# Altium project PR2387.PrjPcb (part 1 of 2)
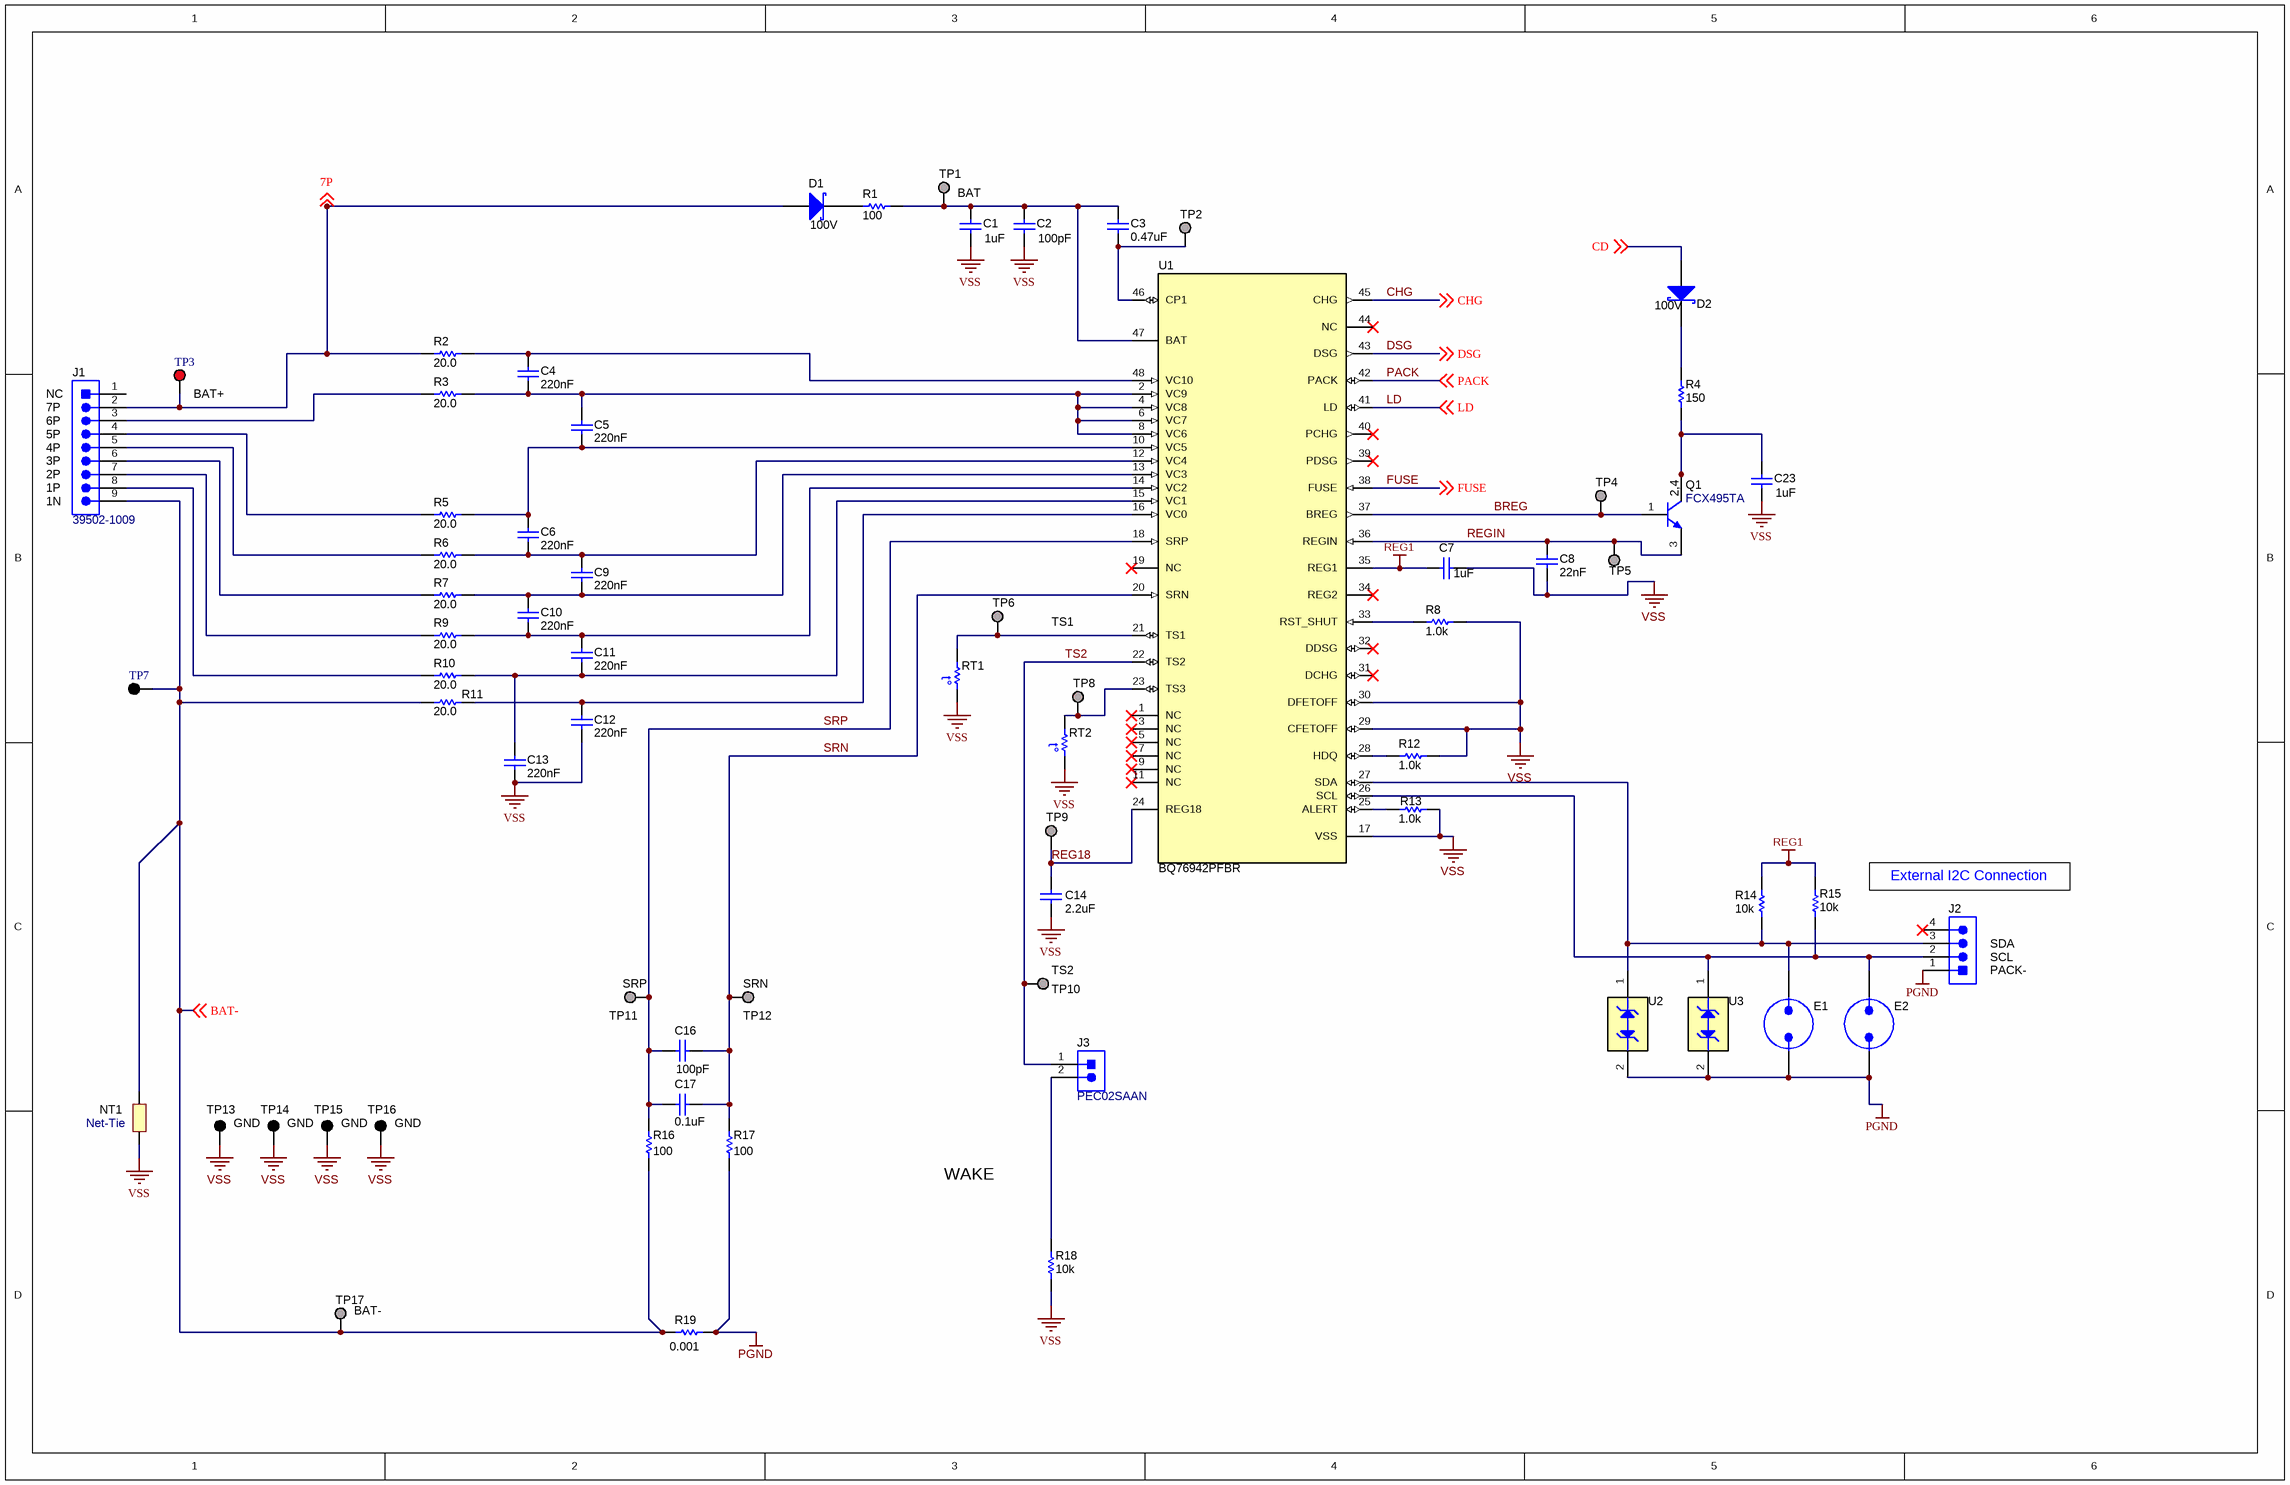
[diagram p0: PR2387_Monitor.SchDoc]
PCB_Rev: A; PRJ_Customer: Test Board; PRJ_Title: BQ76942 7S 2-layer Test Board; SCH_Rev: A; TID: N/A
3 sheets, 131 parts. Net scope: global (net labels, ports and power ports of the same name join across sheets).
Board file: PR2387.PcbDoc
Sheets:
  PR2387_Monitor.SchDoc
  PR2387_FETs.SchDoc
  PR2387_Hardware.SchDoc

## Sheet PR2387_Monitor.SchDoc: Monitor
size 431 x 279 mm; Date: Not shown in title block; ApprovedBy: Not shown in title block; CheckedBy: Not shown in title block; Author: Not shown in title block; CompanyName: Not shown in title block; Engineer: Not shown in title block; Organization: Not shown in title block; Address1: Not shown in title block; Address2: Not shown in title block; Address3: Not shown in title block; Address4: Not shown in title block; DocumentNumber: 1; Revision: Use project parameter SCH_Rev; SheetNumber: 1; SheetTotal: 3; PageSetup: Record=PageOptions|CenterHorizontal=True|CenterVertical=True|PrintScale=1.00|XCorrection=1.00|YCorrection=1.00|PrintKind=0|BorderSize=5000000|LeftOffset=0|BottomOffset=0|Orientation=2|PaperLength=1000|PaperWidth=1000|Scale=100|PaperSource=15|PrintQuality=600|MediaType=1|DitherType=10|PaperKind=Letter|PrintScaleMode=1; CurrentTime: Not shown in title block; CurrentDate: Not shown in title block; Time: Not shown in title block; DocumentFullPathAndName: Not shown in title block; DocumentName: Not shown in title block; ModifiedDate: Not shown in title block; ImagePath: Not shown in title block

### Parts
C1  ValueDisplayed: 1uF  [1206_180]  (hidden comment: C3216X7R2A105K160AA)
C2  ValueDisplayed: 100pF  [0603]  (hidden comment: GCM1885C2A101JA16D)
C3  ValueDisplayed: 0.47uF  [0805_HV]  (hidden comment: GCM219R71E474KA55D)
C4  Cap_F: 220nF  [0603]  (hidden comment: C1608X7R1H224K080AB)
C5  Cap_F: 220nF  [0603]  (hidden comment: C1608X7R1H224K080AB)
C6  Cap_F: 220nF  [0603]  (hidden comment: C1608X7R1H224K080AB)
C7  ValueDisplayed: 1uF  [0805_HV]  (hidden comment: EMK212B7105KG-T)
C8  Cap_F: 22nF  [0603]  (hidden comment: C0603C223K4RACTU)
C9  Cap_F: 220nF  [0603]  (hidden comment: C1608X7R1H224K080AB)
C10  Cap_F: 220nF  [0603]  (hidden comment: C1608X7R1H224K080AB)
C11  Cap_F: 220nF  [0603]  (hidden comment: C1608X7R1H224K080AB)
C12  Cap_F: 220nF  [0603]  (hidden comment: C1608X7R1H224K080AB)
C13  Cap_F: 220nF  [0603]  (hidden comment: C1608X7R1H224K080AB)
C14  ValueDisplayed: 2.2uF  [0805_HV]  (hidden comment: EMK212B7225KG-T)
C16  ValueDisplayed: 100pF  [0603]  (hidden comment: C0603C101J5GACTU)
C17  ValueDisplayed: 0.1uF  [0603]  (hidden comment: 885012206095)
C23  ValueDisplayed: 1uF  [1206_180]  (hidden comment: C3216X7R2A105K160AA)
D1  value 100V  [SOD-123]  (hidden comment: BAT46W-7-F)
D2  value 100V  [SOD-123]  (hidden comment: BAT46W-7-F)
E1  Spark Gap  [SPARK_GAP2]  (value not drawn)  (no BOM)
E2  Spark Gap  [SPARK_GAP2]  (value not drawn)  (no BOM)
J1  39502-1009  [Molex_39502-1009]
J2  22/05/3041  [CONN_22-05-3041]  (value not drawn)
J3  PEC02SAAN  [CONN_PEC02SAAN]
NT1  Net-Tie  [Net-Tie_10milWide_30milLong]  (net tie, no BOM)
Q1  FCX495TA  [SOT-89-3]
R1  ValueDisplayed: 100  [0603]  (hidden comment: Resistor)
R2  ValueDisplayed: 20.0  [1206]  (hidden comment: CRCW120620R0FKEA)
R3  ValueDisplayed: 20.0  [1206]  (hidden comment: CRCW120620R0FKEA)
R4  ValueDisplayed: 150  [2512]  (hidden comment: CRCW2512150RJNEG)
R5  ValueDisplayed: 20.0  [1206]  (hidden comment: CRCW120620R0FKEA)
R6  ValueDisplayed: 20.0  [1206]  (hidden comment: CRCW120620R0FKEA)
R7  ValueDisplayed: 20.0  [1206]  (hidden comment: CRCW120620R0FKEA)
R8  ValueDisplayed: 1.0k  [0603]  (hidden comment: CRCW06031K00JNEA)
R9  ValueDisplayed: 20.0  [1206]  (hidden comment: CRCW120620R0FKEA)
R10  ValueDisplayed: 20.0  [1206]  (hidden comment: CRCW120620R0FKEA)
R11  ValueDisplayed: 20.0  [1206]  (hidden comment: CRCW120620R0FKEA)
R12  ValueDisplayed: 1.0k  [0603]  (hidden comment: CRCW06031K00JNEA)
R13  ValueDisplayed: 1.0k  [0603]  (hidden comment: CRCW06031K00JNEA)
R14  ValueDisplayed: 10k  [0603]  (hidden comment: CRCW060310K0JNEA)
R15  ValueDisplayed: 10k  [0603]  (hidden comment: CRCW060310K0JNEA)
R16  ValueDisplayed: 100  [0603]  (hidden comment: Resistor)
R17  ValueDisplayed: 100  [0603]  (hidden comment: Resistor)
R18  ValueDisplayed: 10k  [0603]  (hidden comment: CRCW060310K0JNEA)
R19  ValueDisplayed: 0.001  [1210M]  (hidden comment: Resistor)
RT1  Thermistor  [THERMISTOR_103AT-2]  (value not drawn)
RT2  Thermistor  [THERMISTOR_103AT-2]  (value not drawn)
TP1  TESTPOINT  [TP_VIA_060RND040]  (value not drawn)  (no BOM)
TP2  TESTPOINT  [TP_VIA_060RND040]  (value not drawn)  (no BOM)
TP3  TESTPOINT  [Keystone5010]  (value not drawn)
TP4  TESTPOINT  [TP_VIA_060RND040]  (value not drawn)  (no BOM)
TP5  TESTPOINT  [TP_VIA_060RND040]  (value not drawn)  (no BOM)
TP6  TESTPOINT  [TP_VIA_060RND040]  (value not drawn)  (no BOM)
TP7  TESTPOINT  [Keystone5011]  (value not drawn)
TP8  TESTPOINT  [TP_VIA_060RND040]  (value not drawn)  (no BOM)
TP9  TESTPOINT  [TP_VIA_060RND040]  (value not drawn)  (no BOM)
TP10  TESTPOINT  [TP_VIA_060RND040]  (value not drawn)  (no BOM)
TP11  TESTPOINT  [TP_VIA_060RND040]  (value not drawn)  (no BOM)
TP12  TESTPOINT  [TP_VIA_060RND040]  (value not drawn)  (no BOM)
TP13  5006  [Keystone5006]  (value not drawn)
TP14  5006  [Keystone5006]  (value not drawn)
TP15  5006  [Keystone5006]  (value not drawn)
TP16  5006  [Keystone5006]  (value not drawn)
TP17  TESTPOINT  [TP_VIA_060RND040]  (value not drawn)  (no BOM)
U1  BQ76942PFBR  [PFB0048A_N]
U2  TPD1E10B06DPYR  [DPY0002A]  (value not drawn)
U3  TPD1E10B06DPYR  [DPY0002A]  (value not drawn)

### Nets
PGND: E1.2 E2.2 J2.1 R17.1 R19.1 U2.2(A) U3.2(A)
REG1: C7.2 R14.1 R15.1 U1.35(REG1)
VSS: C1.2 C2.2 C7.1 C8.1 C12.2 C13.2 C14.1 C23.2 NT1.1 R8.1 R12.1 R13.1 R18.1 RT1.2 RT2.2 TP13.1 TP14.1 TP15.1 TP16.1 U1.17(VSS) U1.29(CFETOFF) U1.30(DFETOFF)
7P: D1.2(A) J1.2 R2.1 TP3.1 ; off-sheet 7P
BAT-: J1.9 NT1.2 R11.1 R16.1 R19.2 TP7.1 TP17.1 ; off-sheet BAT-
BREG: Q1.1(B) TP4.1 U1.37(BREG)
CD: D2.2(A) ; off-sheet CD
CHG: U1.45(CHG) ; off-sheet CHG
DSG: U1.43(DSG) ; off-sheet DSG
FUSE: U1.38(FUSE) ; off-sheet FUSE
LD: U1.41(LD) ; off-sheet LD
PACK: U1.42(PACK) ; off-sheet PACK
REG18: C14.2 TP9.1 U1.24(REG18)
REGIN: C8.2 Q1.3(E) TP5.1 U1.36(REGIN)
SRN: C16.1 C17.2 R17.2 TP12.1 U1.20(SRN)
SRP: C16.2 C17.1 R16.2 TP11.1 U1.18(SRP)
TS2: J3.1 TP10.1 U1.22(TS2)
NetC1_1: C1.1 C2.1 C3.1 R1.1 TP1.1 U1.47(BAT)
NetC3_2: C3.2 TP2.1 U1.46(CP1)
NetC4_1: C4.1 R2.2 U1.48(VC10)
NetC4_2: C4.2 C5.1 R3.2 U1.2(VC9) U1.4(VC8) U1.6(VC7) U1.8(VC6)
NetC5_2: C5.2 C6.1 R5.2 U1.10(VC5)
NetC6_2: C6.2 C9.1 R6.2 U1.12(VC4)
NetC9_2: C9.2 C10.1 R7.2 U1.13(VC3)
NetC10_2: C10.2 C11.1 R9.2 U1.14(VC2)
NetC11_2: C11.2 C13.1 R10.2 U1.15(VC1)
NetC12_1: C12.1 R11.2 U1.16(VC0)
NetC23_1: C23.1 Q1.2(C) Q1.4(C) R4.1
NetD1_1: D1.1(K) R1.2
NetD2_1: D2.1(K) R4.2
NetE1_1: E1.1 J2.3 R14.2 U1.27(SDA) U2.1(K)
NetE2_1: E2.1 J2.2 R15.2 U1.26(SCL) U3.1(K)
NetJ1_3: J1.3 R3.1
NetJ1_4: J1.4 R5.1
NetJ1_5: J1.5 R6.1
NetJ1_6: J1.6 R7.1
NetJ1_7: J1.7 R9.1
NetJ1_8: J1.8 R10.1
NetJ3_2: J3.2 R18.2
NetR8_2: R8.2 U1.33(RST_SHUT)
NetR12_2: R12.2 U1.28(HDQ)
NetR13_2: R13.2 U1.25(ALERT)
NetRT1_1: RT1.1 TP6.1 U1.21(TS1)
NetRT2_1: RT2.1 TP8.1 U1.23(TS3)

Not connected (* = marked no-connect by the designer): J1 1; J2 4*; U1 1(NC)* 3(NC)* 5(NC)* 7(NC)* 9(NC)* 11(NC)* 19(NC)* 31(DCHG)* 32(DDSG)* 34(REG2)* 39(PDSG)* 40(PCHG)* 44(NC)*

### Notes on the sheet
- BAT
- (near J1) 6P
- (near J1) 5P
- (near J1) 7P
- (near J1) NC
- (near TP3) BAT+
- (near J1) 2P
- (near J1) 1P
- (near J1) 1N
- (near J1) 4P
- (near J1) 3P
- TS1
- External I2C Connection
- (near TP10) TS2
- (near J2) PACK-
- (near J2) SDA
- (near J2) SCL
- (near TP11) SRP
- (near TP12) SRN
- GND
- (near TP16) GND
- WAKE
- (near TP17) BAT-
- (in symbol CMP-0000510-2) 2,4
- (in symbol CMP-0002341-2) t°

### Library data of the parts
C1 C23 = CMP-0008710-2: CAP, CERM, 1 uF, 100 V, +/- 10%, X7R, 1206; Manufacturer: TDK; TaMin_C: -55°C; ESR_ohm: 4.575m; Polarized: N; SizeAreaWB_mm2: 10.92; Value1: 0.004575 ohm; U/M: EA; Value: 1uF; TaMax_C: 125°C; SizeZ_mm: 1.8; SizeX_mm: 3.2; SizeY_mm: 1.6; Value2: 100V; SizeArea_mm2: 5.12; Cap_F: 1µF; IRMS_A: 3.39639A; AEC Category: Q200; Supplier Part Number 2: 810-C3216X7R2A105K160AA; Publisher: Texas Instruments; Supplier 2: Mouser; TempCo: X7R; Published: 2008-06-19; RoHS: Y; MountType: SMT; Supplier 1: Digi-Key; PackageReference: 1206; Tolerance_%: 10%; Cap_Case: 1206_180; CompType: Capacitor; LatestRevisionDate: 2017-03-09; PartNumber: C3216X7R2A105K160AA; AEC Qualified: N; VDC_V: 100V; ComponentLink1Description: Datasheet link; AEC Grade: N/A; Supplier Part Number 1: 445-4467-1-ND; Technology: Ceramic; ComponentLink1URL: https://product.tdk.com/en/search/capacitor/ceramic/mlcc/info?part_no=C3216X7R2A105K160AA
C2 = CMP-0007130-4: CAP, CERM, 100 pF, 100 V, +/- 5%, C0G/NP0, AEC-Q200 Grade 1, 0603; Manufacturer: MuRata; TaMin_C: -55°C; Polarized: N; SizeAreaWB_mm2: 4.68; Value1: Unknown; U/M: EA; TaMax_C: 125°C; SizeZ_mm: 1; SizeX_mm: 1.6; SizeY_mm: 0.8; Value2: 100V; SizeArea_mm2: 1.28; AEC Qualified: Y; AEC Category: Q200; Value: 100pF; Supplier Part Number 2: 81-GCM1885C2A101JA6D; Publisher: Texas Instruments; Supplier 2: Mouser; TempCo: C0G/NP0; Published: 2008-06-19; RoHS: Y; MountType: SMT; Supplier 1: Digi-Key; PackageReference: 0603; Tolerance_%: 5%; Cap_Case: 0603; CompType: Capacitor; LatestRevisionDate: 2017-03-09; PartNumber: GCM1885C2A101JA16D; Cap_F: 100pF; VDC_V: 100V; ComponentLink1Description: Datasheet link; AEC Grade: 1; Supplier Part Number 1: 490-4771-1-ND; Technology: Ceramic; ComponentLink1URL: http://psearch.murata.com/capacitor/product/GCM1885C2A101JA16%23.pdf
C3 = CMP-0008010-2: CAP, CERM, 0.47 uF, 25 V, +/- 10%, X7R, AEC-Q200 Grade 1, 0805; Manufacturer: MuRata; TaMin_C: -55°C; Polarized: N; SizeAreaWB_mm2: 6.75; Value1: Unknown; U/M: EA; Value: 0.47uF; TaMax_C: 125°C; SizeZ_mm: 1.45; SizeX_mm: 2; SizeY_mm: 1.25; Cap_Case: 0805; Value2: 25V; SizeArea_mm2: 2.5; AEC Qualified: Y; Cap_F: 470nF; AEC Grade: 1; AEC Category: Q200; Supplier Part Number 2: 81-GCM219R71E474KA5D; Publisher: Texas Instruments; Supplier 2: Mouser; TempCo: X7R; Published: 2008-06-19; RoHS: Y; MountType: SMT; Supplier 1: Digi-Key; PackageReference: 0805; Tolerance_%: 10%; CompType: Capacitor; LatestRevisionDate: 2017-03-09; PartNumber: GCM219R71E474KA55D; VDC_V: 25V; ComponentLink1Description: Datasheet link; Supplier Part Number 1: 490-8044-1-ND; Technology: Ceramic; ComponentLink1URL: http://psearch.murata.com/capacitor/product/GCM219R71E474KA55%23.pdf
C4-C6 C9-C13 = CMP-0007047-4: CAP, CERM, 0.22 uF, 50 V, +/- 10%, X7R, 0603; Manufacturer: TDK; TaMin_C: -55°C; Polarized: N; SizeAreaWB_mm2: 4.68; Value1: 0.021699 ohm; U/M: EA; Value: 0.22uF; TaMax_C: 125°C; SizeZ_mm: 1; SizeX_mm: 1.6; SizeY_mm: 0.8; Value2: 50V; SizeArea_mm2: 1.28; AEC Category: Q200; ESR_ohm: 0.021699; IRMS_A: 1.12496A; Publisher: Texas Instruments; TempCo: X7R; Published: 2008-06-19; RoHS: Y; MountType: SMT; PackageReference: 0603; Tolerance_%: 10%; Cap_Case: 0603; CompType: Capacitor; LatestRevisionDate: 2017-03-09; PartNumber: C1608X7R1H224K080AB; AEC Qualified: N; ComponentLink1Description: Datasheet link; AEC Grade: N/A; Technology: Ceramic; ValueDisplayed: 0.22uF; ComponentLink1URL: https://product.tdk.com/en/search/capacitor/ceramic/mlcc/info?part_no=C1608X7R1H224K080AB; Supplier 1: Digi-Key; Supplier 2: Newark; Supplier 3: Mouser; Supplier Part Number 1: 445-7408-1-ND; Supplier Part Number 2: 04X3259; Supplier Part Number 3: 810-C1608X7R1H224K; VDC_V: 50V
C7 = CMP-0008000-2: CAP, CERM, 1 uF, 16 V, +/- 10%, X7R, 0805; Manufacturer: Taiyo Yuden; TaMin_C: -55°C; Polarized: N; SizeAreaWB_mm2: 6.75; Value1: Unknown; U/M: EA; Value: 1uF; TaMax_C: 125°C; SizeZ_mm: 1.45; SizeX_mm: 2; SizeY_mm: 1.25; Cap_Case: 0805; Value2: 16V; SizeArea_mm2: 2.5; Cap_F: 1µF; AEC Category: Q200; Supplier Part Number 2: 1683653; Publisher: Texas Instruments; Supplier 2: Farnell; TempCo: X7R; Published: 2008-06-19; RoHS: Y; MountType: SMT; Supplier 1: Digi-Key; PackageReference: 0805; Tolerance_%: 10%; CompType: Capacitor; LatestRevisionDate: 2017-03-09; PartNumber: EMK212B7105KG-T; AEC Qualified: ?; VDC_V: 16V; ComponentLink1Description: Datasheet link; Supplier Part Number 1: 587-1283-1-ND; Technology: Ceramic; ComponentLink1URL: http://www.yuden.co.jp/ut/product/pdf/djmk_e.pdf
C8 = CMP-0006900-4: CAP, CERM, 0.022 uF, 16 V, +/- 10%, X7R, 0603; Manufacturer: Kemet; TaMin_C: -55°C; Polarized: N; SizeAreaWB_mm2: 4.68; Value1: Unknown; U/M: EA; TaMax_C: 125°C; SizeZ_mm: 1; SizeX_mm: 1.6; SizeY_mm: 0.8; Value2: 16V; SizeArea_mm2: 1.28; AEC Category: Q200; Supplier Part Number 2: 80-C0603C223K4R; Publisher: Texas Instruments; Supplier 2: Mouser; TempCo: X7R; Published: 2008-06-19; RoHS: Y; MountType: SMT; Value: 0.022uF; Supplier 1: Digi-Key; PackageReference: 0603; Tolerance_%: 10%; Cap_Case: 0603; CompType: Capacitor; LatestRevisionDate: 2017-03-09; PartNumber: C0603C223K4RACTU; AEC Qualified: ?; VDC_V: 16V; ComponentLink1Description: Datasheet link; Supplier Part Number 1: 399-1093-1-ND; Technology: Ceramic; ValueDisplayed: 0.022uF; ComponentLink1URL: http://www.kemet.com/kemet/web/homepage/kechome.nsf/vapubfiles/F3102_Y5V.pdf/$file/F3102_Y5V.pdf; Supplier 3: Farnell; Supplier Part Number 3: 1204523
C14 = CMP-0008001-2: CAP, CERM, 2.2 uF, 16 V, +/- 10%, X7R, 0805; Manufacturer: Taiyo Yuden; TaMin_C: -55°C; Polarized: N; SizeAreaWB_mm2: 6.75; Value1: Unknown; U/M: EA; Value: 2.2uF; TaMax_C: 125°C; SizeZ_mm: 1.45; SizeX_mm: 2; SizeY_mm: 1.25; Cap_Case: 0805; Value2: 16V; SizeArea_mm2: 2.5; Cap_F: 2.2µF; AEC Category: Q200; Supplier Part Number 2: 1683654; Publisher: Texas Instruments; Supplier 2: Farnell; TempCo: X7R; Published: 2008-06-19; RoHS: Y; MountType: SMT; Supplier 1: Digi-Key; PackageReference: 0805; Tolerance_%: 10%; CompType: Capacitor; LatestRevisionDate: 2017-03-09; PartNumber: EMK212B7225KG-T; AEC Qualified: ?; VDC_V: 16V; ComponentLink1Description: Datasheet link; Supplier Part Number 1: 587-1431-1-ND; Technology: Ceramic; ComponentLink1URL: http://www.yuden.co.jp/ut/product/pdf/djmk_e.pdf
C16 = CMP-0006841-4: CAP, CERM, 100 pF, 50 V, +/- 5%, C0G/NP0, 0603; Manufacturer: Kemet; TaMin_C: -55°C; Polarized: N; SizeAreaWB_mm2: 4.68; Value1: Unknown; U/M: EA; Value: 100pF; TaMax_C: 125°C; SizeZ_mm: 1; SizeX_mm: 1.6; SizeY_mm: 0.8; Value2: 50V; SizeArea_mm2: 1.28; AEC Category: Q200; Supplier Part Number 2: 80-C0603C101J5G; Publisher: Texas Instruments; Supplier 2: Mouser; Supplier Part Number 3: 1414603; TempCo: C0G/NP0; Supplier 3: Farnell; Published: 2008-06-19; RoHS: Y; MountType: SMT; Supplier 1: Digi-Key; PackageReference: 0603; Tolerance_%: 5%; Cap_Case: 0603; CompType: Capacitor; LatestRevisionDate: 2017-03-09; PartNumber: C0603C101J5GACTU; AEC Qualified: ?; Cap_F: 100pF; VDC_V: 50V; ComponentLink1Description: Datasheet link; Supplier Part Number 1: 399-1061-1-ND; Technology: Ceramic; ComponentLink1URL: http://www.kemet.com/kemet/web/homepage/kechome.nsf/vapubfiles/F3102_Y5V.pdf/$file/F3102_Y5V.pdf
C17 = CMP-0006837-4: CAP, CERM, 0.1 uF, 50 V, +/- 10%, X7R, 0603; Manufacturer: Wurth Elektronik; TaMin_C: -55°C; Polarized: N; SizeAreaWB_mm2: 4.68; Value1: Unknown; U/M: EA; Value: 0.1uF; TaMax_C: 125°C; SizeZ_mm: 1; SizeX_mm: 1.6; SizeY_mm: 0.8; Value2: 50V; SizeArea_mm2: 1.28; Cap_F: 100nF; AEC Category: Q200; Publisher: Texas Instruments; TempCo: X7R; Published: 2008-06-19; RoHS: Y; MountType: SMT; PackageReference: 0603; Tolerance_%: 10%; Cap_Case: 0603; CompType: Capacitor; LatestRevisionDate: 2017-03-09; PartNumber: 885012206095; AEC Qualified: N; ComponentLink1Description: Datasheet link; AEC Grade: N/A; Technology: Ceramic; ComponentLink1URL: http://katalog.we-online.de/pbs/datasheet/885012206095.pdf
D1 D2 = CMP-0028450-2: Diode, Schottky, 100 V, 0.15 A, SOD-123; Manufacturer: Diodes Inc.; Io_A: 150mA; SizeArea_mm2: 6.545; SizeX_mm: 3.85; Value2: 0.6V; Value1: 0.15A; AEC Category: Q101; SizeZ_mm: 1.35; SizeY_mm: 1.7; Green_Lifecycle: Active; Green_REACh: Passed; SizeAreaWB_mm2: 13.095; Vf_V: 600mV; ComponentLink1Description: Datasheet link; MountType: SMT; ComponentLink1URL: http://www.diodes.com/datasheets/ds30044.pdf; Vr_V: 100V; PartNumber: BAT46W-7-F; Type: Schottky; AEC Qualified: ?; Green_EU RoHS-2: Passed; Green_EU RoHS: Passed; CompType: Diode; RoHS: Y; PackageReference: SOD-123
E1 E2 = CMP-0079939-1: CompType: Spark Gap
J1 = CMP-0055280-1: Header(Shrouded), 3.5mm, 9x1, R/A, TH; Manufacturer: Molex; CNHeader: FALSE; Current_A: 8A; Shrouded: Y; Gender: Male; Voltage_V: 300V; Row_Count: 1; Pitch_mm: 3.5; ContactFinish: Tin; ComponentLink1URL: http://www.molex.com/pdm_docs/sd/395021002_sd.pdf; Supplier Part Number 2: 03N5777; Publisher: Texas Instruments; Supplier 2: Newark; Supplier Part Number 3: 538-39502-1009; Color: Black; Supplier 3: Mouser; RoHS: Y; MountType: TH; Supplier 1: Digi-Key; PackageReference: Header(Shrouded), 3.5mm, 9x1, R/A, TH; PinCount: 9; CompType: Header; LatestRevisionDate: 26/05/2017; PartNumber: 39502-1009; Orientation: R/A; ComponentLink1Description: Datasheet URL; Supplier Part Number 1: WM7777-ND; CT: FALSE; Cert_UL: Y
J2 = CMP-0055187-1: Header (friction lock), 100mil, 4x1, R/A, TH; Manufacturer: Molex; Green_Lifecycle: Active; Green_REACh: Passed; CNHeader: FALSE; ComponentLink1URL: http://www.molex.com/pdm_docs/sd/022053041_sd.pdf; PackageReference: 4x1 R/A Header; PartNumber: 22/05/3041; ComponentLink1Description: Datasheet URL; CompType: Header; RoHS: Y; MountType: TH; Publisher: Texas Instruments; LatestRevisionDate: 26/05/2017; Supplier 1: Digi-Key; Supplier Part Number 1: WM4302-ND; Supplier 2: Newark; Supplier Part Number 2: 27C1932; Supplier 3: Mouser; Supplier Part Number 3: 538-22-05-3041; Green_EU RoHS: Passed; Green_EU RoHS-2: Passed; CT: FALSE
J3 = CMP-0002337-1: Header, 100mil, 2x1, Tin, TH; Manufacturer: Sullins Connector Solutions; CNHeader: TRUE; Current_A: 3A; Green_Lifecycle: Not Set; Shrouded: N; Gender: Male; Green_REACh: Incomplete; Voltage_V: 1.8kV; Row_Count: 1; Pitch_mm: 2.54; CT: FALSE; Cert_UL: Y; ComponentLink1URL: http://www.sullinscorp.com/catalogs/77_PAGE108-109_.100_MALE_HDR.pdf; ClassName: Header; Publisher: Texas Instruments; Color: Black; RoHS: Y; MountType: TH; Green_EU RoHS-2: Incomplete; Supplier 1: Digi-Key; Green_EU RoHS: Incomplete; PackageReference: Header, 2 PIN, 100mil, Tin; PinCount: 2; CompType: Header; LatestRevisionDate: 26/05/2017; PartNumber: PEC02SAAN; Orientation: Vertical; ComponentLink1Description: Datasheet URL; Supplier Part Number 1: S1012E-02-ND; ContactFinish: Tin
NT1 = CMP-0078142-3: Single point connection between nets.; MountType: SMT; PackageReference: N/A; CompType: Net-Tie; Library Reference: Net-Tie; Manufacturer: N/A; PartNumber: N/A
Q1 = CMP-0000510-2: Transistor, NPN, 150 V, 1 A, AEC-Q101, SOT-89; Manufacturer: Diodes Inc.; TaMax_C: 150°C; Value2: 300; Value1: 1 A; Vcesat1_V: 200mV; SizeX_mm: 4.1; SizeY_mm: 4.5; TaMin_C: -65°C; IcRated_A: 1A; CompType: BJT; SizeZ_mm: 1.5; AEC Qualified: Y; Value: 150 V; SizeArea_mm2: 18.45; NPN: 1; Vceo_V: 150V; PNP: 0; AEC Category: Q101; SizeAreaWB_mm2: 28.05; U/M: EA; Supplier 2: Newark; Supplier 3: Mouser; Supplier 1: Digi-Key; Supplier Part Number 1: FCX495CT-ND; Supplier Part Number 2: 65T9121; Supplier Part Number 3: 522-FCX495TA; PartNumber: FCX495TA; LatestRevisionDate: 2017-03-09; Publisher: Texas Instruments; ComponentLink1Description: Datasheet link; HfeMax: 300; Published: 2008-07-31; RoHS: Y; PackageReference: SOT-89; MountType: SMT; ComponentLink1URL: https://www.diodes.com/assets/Datasheets/FCX495.pdf
R1 R16 R17 = CMP-0025700-4: RES, 100, 5%, 0.1 W, AEC-Q200 Grade 0, 0603; PartNumber: CRCW0603100RJNEA; Manufacturer: Vishay-Dale; Value: 100; Value_Code: 100R; Power_W: 100mW; Value2: 0.1W; VDC_V: 75V; TempCo: 200 ppm/C; EIA_Code: E24; U/M: EA; SizeArea_mm2: 1.28; SizeX_mm: 1.6; SizeY_mm: 0.8; SizeZ_mm: 1; AEC Category: Q200; AEC Qualified: Y; AEC Grade: 0; CompType: Resistor; SymbolVersion: 2009-05-29; PackageReference: 0603; RoHS: E; Res_ohm: 100; Tolerance_%: 5%; Value1: 5%; MountType: SMT; Technology: Thick Film; Published: 2008-06-26; Publisher: Texas Instruments; LatestRevisionDate: 2017-06-13; ComponentLink1Description: Datasheet link; ComponentLink1URL: http://www.vishay.com/docs/20035/dcrcwe3.pdf; Supplier 1: Digi-Key; Supplier Part Number 1: 541-100GCT-ND; Supplier 2: Newark; Supplier Part Number 2: 59M6764; Supplier 3: Mouser; Supplier Part Number 3: 71-CRCW0603J-100-E3
R2 R3 R5-R7 R9-R11 = CMP-0016781-3: RES, 20.0, 1%, 0.25 W, AEC-Q200 Grade 0, 1206; Manufacturer: Vishay-Dale; Value: 20.0; Res_ohm: 20; Value_Code: 20R0; Power_W: 250mW; Value2: 0.25W; VDC_V: 200V; TempCo: 100 ppm/C; EIA_Code: E96; SizeArea_mm2: 5.12; SizeX_mm: 3.2; SizeY_mm: 1.6; SizeZ_mm: 1.35; AEC Category: Q200; AEC Qualified: Y; AEC Grade: 0; CompType: Resistor; PartNumber: CRCW120620R0FKEA; PackageReference: 1206; RoHS: E; Tolerance_%: 1%; Value1: 1%; MountType: SMT; Technology: Thick Film; ComponentLink1Description: Datasheet link; ComponentLink1URL: http://www.vishay.com/docs/20035/dcrcwe3.pdf; Supplier 1: Digi-Key; Supplier Part Number 1: 541-20.0FCT-ND; Supplier 2: Newark; Supplier Part Number 2: 42K4894; Supplier 3: Mouser; Supplier Part Number 3: 71-CRCW1206-20-E3
R4 = CMP-0015884-3: RES, 150, 5%, 1 W, AEC-Q200 Grade 0, 2512; Manufacturer: Vishay-Dale; Power_W: 1W; TempCo: 200 ppm/C; Value_Code: 150R; Value: 150; EIA_Code: E24; SizeX_mm: 6.3; SizeY_mm: 3.2; SizeZ_mm: 0.71; SizeArea_mm2: 20.16; AEC Qualified: Y; VDC_V: 500V; AEC Grade: 0; AEC Category: Q200; RoHS: E; Value1: 5%; MountType: SMT; Supplier 1: Digi-Key; PackageReference: 2512; Tolerance_%: 5%; Res_ohm: 150; Value2: 1W; CompType: Resistor; PartNumber: CRCW2512150RJNEG; ComponentLink1Description: Datasheet link; Supplier Part Number 1: 541-150XCT-ND; Technology: Thick Film; ComponentLink1URL: http://www.vishay.com/docs/20035/dcrcwe3.pdf
R8 R12 R13 = CMP-0025729-4: RES, 1.0 k, 5%, 0.1 W, AEC-Q200 Grade 0, 0603; Manufacturer: Vishay-Dale; Power_W: 100mW; TempCo: 200 ppm/C; Value_Code: 1k00; Value: 1.0k; EIA_Code: E24; Res_ohm: 1k; SizeX_mm: 1.6; SizeY_mm: 0.8; SizeZ_mm: 1; Value2: 0.1W; SizeArea_mm2: 1.28; AEC Qualified: Y; VDC_V: 75V; AEC Category: Q200; AEC Grade: 0; Supplier Part Number 2: 59M6750; Supplier 2: Newark; Supplier Part Number 3: 71-CRCW0603J-1.0K-E3; Supplier 3: Mouser; RoHS: E; Value1: 5%; MountType: SMT; Supplier 1: Digi-Key; PackageReference: 0603; Tolerance_%: 5%; CompType: Resistor; PartNumber: CRCW06031K00JNEA; ComponentLink1Description: Datasheet link; Supplier Part Number 1: 541-1.0KGCT-ND; Technology: Thick Film; ComponentLink1URL: http://www.vishay.com/docs/20035/dcrcwe3.pdf
R14 = CMP-0025701-4: RES, 10 k, 5%, 0.1 W, AEC-Q200 Grade 0, 0603; Manufacturer: Vishay-Dale; Power_W: 100mW; TempCo: 200 ppm/C; Value_Code: 10k0; Value: 10k; EIA_Code: E24; SizeX_mm: 1.6; SizeY_mm: 0.8; SizeZ_mm: 1; Value2: 0.1W; SizeArea_mm2: 1.28; AEC Qualified: Y; VDC_V: 75V; AEC Category: Q200; AEC Grade: 0; Supplier Part Number 2: 52K8066; Supplier 2: Newark; Supplier Part Number 3: 71-CRCW0603J-10K-E3; Supplier 3: Mouser; RoHS: E; Value1: 5%; MountType: SMT; Supplier 1: Digi-Key; PackageReference: 0603; Tolerance_%: 5%; Res_ohm: 10k; CompType: Resistor; PartNumber: CRCW060310K0JNEA; ComponentLink1Description: Datasheet link; Supplier Part Number 1: 541-10KGCT-ND; Technology: Thick Film; ComponentLink1URL: http://www.vishay.com/docs/20035/dcrcwe3.pdf
R15 = CMP-0025701-4: RES, 10 k, 5%, 0.1 W, AEC-Q200 Grade 0, 0603; Manufacturer: Vishay-Dale; Power_W: 100mW; TempCo: 200 ppm/C; Value_Code: 10k0; Value: 10k; EIA_Code: E24; SizeX_mm: 1.6; SizeY_mm: 0.8; SizeZ_mm: 1; Value2: 0.1W; SizeArea_mm2: 1.28; CompType: Resistor; AEC Qualified: Y; VDC_V: 75V; AEC Category: Q200; AEC Grade: 0; Supplier Part Number 2: 52K8066; Supplier 2: Newark; Supplier Part Number 3: 71-CRCW0603J-10K-E3; Supplier 3: Mouser; RoHS: E; Value1: 5%; MountType: SMT; Supplier 1: Digi-Key; PackageReference: 0603; Tolerance_%: 5%; Res_ohm: 10k; PartNumber: CRCW060310K0JNEA; ComponentLink1Description: Datasheet link; Supplier Part Number 1: 541-10KGCT-ND; Technology: Thick Film; ComponentLink1URL: http://www.vishay.com/docs/20035/dcrcwe3.pdf
R18 = CMP-0025701-4: RES, 10 k, 5%, 0.1 W, AEC-Q200 Grade 0, 0603; Manufacturer: Vishay-Dale; Power_W: 100mW; TempCo: 200 ppm/C; Value_Code: 10k0; Value: 10k; EIA_Code: E24; SizeX_mm: 1.6; SizeY_mm: 0.8; SizeZ_mm: 1; Value2: 0.1W; SizeArea_mm2: 1.28; AEC Qualified: Y; VDC_V: 75V; AEC Grade: 0; AEC Category: Q200; Supplier Part Number 2: 52K8066; Supplier 2: Newark; RoHS: E; Value1: 5%; MountType: SMT; Supplier 1: Digi-Key; PackageReference: 0603; Tolerance_%: 5%; Res_ohm: 10k; CompType: Resistor; PartNumber: CRCW060310K0JNEA; ComponentLink1Description: Datasheet link; Supplier Part Number 1: 541-10KGCT-ND; Technology: Thick Film; ComponentLink1URL: http://www.vishay.com/docs/20035/dcrcwe3.pdf; Supplier 3: Mouser; Supplier Part Number 3: 71-CRCW0603J-10K-E3
R19 = CMP-0015200-2: RES, 0.001, 1%, 1 W, 1210; PartNumber: PMR25HZPFV1L00; Manufacturer: Rohm; Value: 0.001; Res_ohm: 1m; Value_Code: 1L000; Power_W: 1W; TempCo: 100 ppm/C; EIA_Code: E96; U/M: EA; SizeArea_mm2: 8; SizeAreaWB_mm2: 14.7; SizeX_mm: 3.2; SizeY_mm: 2.5; SizeZ_mm: 1.35; AEC Category: Q200; Green_Lifecycle: Active; Green_REACh: Passed; CompType: Resistor; SymbolVersion: 2009-05-29; PackageReference: 1210; RoHS: Y; Tolerance_%: 1%; Value1: 1%; Value2: 1W; MountType: SMT; Technology: Thick Film; Published: 2008-06-26; Publisher: Texas Instruments; LatestRevisionDate: 2017-03-09; ComponentLink1Description: Datasheet link; ComponentLink1URL: http://media.digikey.com/pdf/Data%20Sheets/Rohm%20PDFs/PMR25-Series.pdf; Supplier 1: Digi-Key; Supplier Part Number 1: RHM.001APCT-ND; AEC Qualified: ?; Green_EU RoHS: Passed; Green_EU RoHS-2: Incomplete
RT1 RT2 = CMP-0002341-2: Thermistor NTC, 10.0k ohm, 1%, Disc, 5x8.4 mm; PartNumber: 103AT-2; Manufacturer: SEMITEC Corporation; Power_W: 10mW; TaMin_C: -50°C; TaMax_C: 110°C; U/M: EA; Value: 10k; CompType: ThermistorNTC; SymbolVersion: 2008-11-25; Series: AT; PackageReference: Disc, 5x8.4 mm; Tolerance_%: 1%; MountType: TH; RoHS: Y; ComponentLink1Description: Datasheet link; ComponentLink1URL: http://www.semitec.co.jp/english2/products/pdf/AT_Thermistor.pdf; Published: 22/09/2009; Publisher: Texas Instruments; LatestRevisionDate: 09/03/2017; Supplier 1: Mouser; Supplier Part Number 1: 954-103AT-2
TP1 TP2 TP4-TP6 TP8-TP12 TP17 = CMP-0078143-3: TEST POINT.  No entry in BOM.; PartNumber: N/A; CompType: Testpoint; Manufacturer: N/A; PackageReference: N/A; Library Reference: TESTPOINT
TP3 = CMP-0055147-1: Test Point, Multipurpose, Red, TH; Manufacturer: Keystone; CNHeader: FALSE; Green_Lifecycle: Active; Green_REACh: Passed; ContactFinish: Silver; CT: TRUE; CompType: Test Point; PackageReference: Red Multipurpose Testpoint; PartNumber: 5010; ComponentLink1URL: http://www.keyelco.com/userAssets/file/M60-2p60.pdf; Supplier Part Number 2: 534-5010; Publisher: Texas Instruments; Supplier 2: Mouser; Color: Red; RoHS: Y; MountType: TH; Green_EU RoHS-2: Incomplete; Supplier 1: Digi-Key; Green_EU RoHS: Passed; LatestRevisionDate: 26/05/2017; ComponentLink1Description: Datasheet URL; Supplier Part Number 1: 36-5010-ND
TP7 = CMP-0055148-1: Test Point, Multipurpose, Black, TH; Manufacturer: Keystone; CNHeader: FALSE; Green_Lifecycle: Active; Green_REACh: Passed; ContactFinish: Silver; CT: TRUE; CompType: Test Point; PackageReference: Black Multipurpose Testpoint; PartNumber: 5011; ComponentLink1URL: http://www.keyelco.com/userAssets/file/M60-2p60.pdf; Supplier Part Number 2: 534-5011; Publisher: Texas Instruments; Supplier 2: Mouser; Color: Black; RoHS: Y; MountType: TH; Green_EU RoHS-2: Incomplete; Supplier 1: Digi-Key; Green_EU RoHS: Passed; LatestRevisionDate: 26/05/2017; ComponentLink1Description: Datasheet URL; Supplier Part Number 1: 36-5011-ND
TP13-TP16 = CMP-0055143-1: Test Point, Compact, Black, TH; Manufacturer: Keystone; ContactFinish: Silver; Green_Lifecycle: Active; Green_REACh: Passed; CNHeader: FALSE; CT: TRUE; SymbolVersion: 2008-04-04; PartNumber: 5006; CompType: Test Point; RoHS: Y; PackageReference: Black Compact Testpoint; MountType: TH; ComponentLink1Description: Datasheet URL; ComponentLink1URL: http://www.keyelco.com/userAssets/file/M60-2p60.pdf; Publisher: Texas Instruments; LatestRevisionDate: 26/05/2017; Supplier 1: Digi-Key; Supplier Part Number 1: 36-5006-ND; Supplier 2: Mouser; Supplier Part Number 2: 534-5006; Color: Black; Green_EU RoHS: Passed; Green_EU RoHS-2: Incomplete
U1 = CMP-0750064-1: Multicell Battery Monitor and Protection Family, PFB0048A (TQFP-48); Alternate PartNumber: BQ76942PFBT; Alternate Manufacturer: Texas Instruments; SizeZ_mm: 1.2; SizeX_mm: 9; AEC Qualified: N; CompType: IC; SizeAreaWB_mm2: 121; SizeArea_mm2: 81; AEC Category: Q200; ComponentLink1URL: http://www.ti.com/lit/ds/symlink/bq76942.pdf; ComponentLink3URL: http://www.ti.com/product/bq76942/datasheet; PackageDescription: TQFP-48; ComponentLink3Description: Online Datasheet; Manufacturer: Texas Instruments; SizeY_mm: 9; PartNumber: BQ76942PFBR; MountType: SMT; ComponentLink1Description: Datasheet Link; PackageReference: PFB0048A; ComponentLink2Description: Product Folder; ComponentLink2URL: http://www.ti.com/product/bq76942
U2 U3 = CMP-0043093-4: Single-Channel ESD in 0402 Package With 10pF Capacitance and 6V Breakdown, DPY0002A (X1SON-2); Manufacturer: Texas Instruments; Alternate PartNumber: TPD1E10B06DPYT; IEC 61000-4-2 Air-Gap(+/- kV): 30; Eco-Plan: TBD; IO Capacitance(Typ)(pF): 10; Breakdown Voltage(Min)(V): 6; AEC Category: Q200; AEC Qualified: N; CompType: IC; Green_Lifecycle: Active; Green_REACh: Passed; SizeAreaWB_mm2: 3.2; SizeArea_mm2: 0.6; SizeX_mm: 1.0; SizeZ_mm: 0.45; Rating: Catalog; ComponentLink3Description: Online Datasheet; PackageReference: DPY0002A; PackageDescription: X1SON-2; ComponentLink2URL: http://www.ti.com/product/tpd1e10b06; ComponentLink1URL: http://www.ti.com/lit/ds/symlink/tpd1e10b06.pdf; ComponentLink3URL: http://www.ti.com/product/tpd1e10b06/datasheet; IO Leakage Current(nA): 10; ComponentLink1Description: Datasheet Link; ComponentLink2Description: Product Folder; IEC 61000-4-2 Contact(+/- kV): 30; Alternate Manufacturer: Texas Instruments; Green_EU RoHS: Passed; Green_EU RoHS-2: Passed; MountType: SMT; RoHS: Y; SizeY_mm: 0.6; Operating Temperature Range: -40 to 125 C